# Altium schematic sheet 7.Humidifier.SchDoc
size A4; SheetNumber: 8; SheetTotal: 13
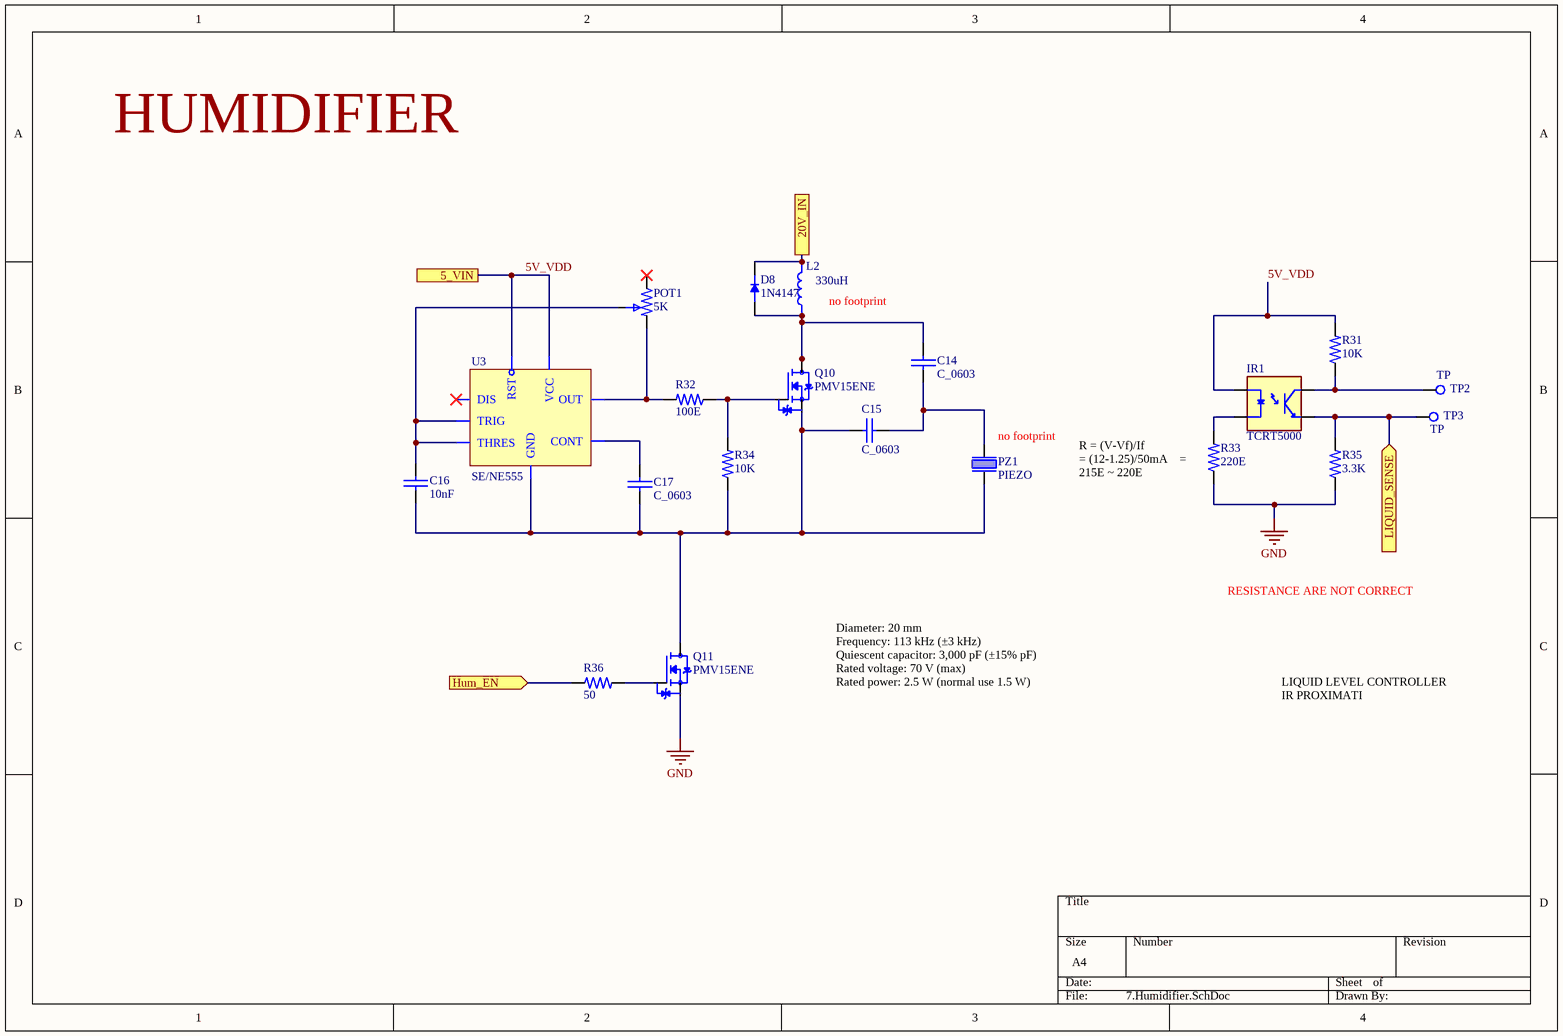
[diagram p0: 7.Humidifier.SchDoc]

## Parts
C14  C_0603  [C_0603]
C15  C_0603  [C_0603]
C16  10nF  [C_0603]
C17  C_0603  [C_0603]
D8  1N4147  [SOD123]
IR1  TCRT5000  [TCRT5000]
L2  330uH  [2P5mm_PITCH_COM]
POT1  5K  [TC33 - 3 mm SMD Trimpot]
PZ1  PIEZO  [2P5mm_PITCH_COM]
Q10  PMV15ENE  [SOT23FR]
Q11  PMV15ENE  [SOT23FR]
R31  10K  [R_0603]
R32  100E  [R_0603]
R33  220E  [R_0603]
R34  10K  [R_0603]
R35  3.3K  [R_0603]
R36  50  [R_0603]
TP2  TP
TP3  TP
U3  SE/NE555  [SOIC-8]

## Ports
5_VIN, 20V_IN, Hum_EN (in), LIQUID_SENSE (in)

## Nets
GND: Q11.3(S) R33.1 R35.1
5V_VDD: IR1.A R31.2 U3.4(RST) U3.8(VCC) ; port 5_VIN
20V_IN: D8.C(K) L2.2 ; port 20V_IN
Hum_EN: R36.1 ; port Hum_EN
LIQUID_SENSE: IR1.E R35.2 TP3.1 ; port LIQUID_SENSE
NetC14_1: C14.1 C15.1 PZ1.2
NetC14_2: C14.2 D8.A L2.1 Q10.1(D)
NetC15_2: C15.2 C16.1 C17.1 PZ1.1 Q10.3(S) Q11.1(D) R34.1 U3.1(GND)
NetC16_2: C16.2 POT1.2(W) U3.2(TRIG) U3.6(THRES)
NetC17_2: C17.2 U3.5(CONT)
NetIR1_CATH: IR1.CATH R33.2
NetIR1_COLL: IR1.COLL R31.1 TP2.1
NetPOT1_3: POT1.3(CW) R32.2 U3.3(OUT)
NetQ10_2: Q10.2(G) R32.1 R34.2
NetQ11_2: Q11.2(G) R36.2

Not connected (* = marked no-connect by the designer): POT1 1(CCW)*; U3 7(DIS)*

## Notes on the sheet
- HUMIDIFIER
- (near L2) no footprint
- (near PZ1) no footprint
- (near R33) R = (V-Vf)/If             = (12-1.25)/50mA    = 215E ~ 220E
- RESISTANCE ARE NOT CORRECT
- Diameter: 20 mm
  Frequency: 113 kHz (±3 kHz)
  Quiescent capacitor: 3,000 pF (±15% pF)
  Rated voltage: 70 V (max)
  Rated power: 2.5 W (normal use 1.5 W)
- LIQUID LEVEL CONTROLLER   IR PROXIMATI

## Library data of the parts
C16 = C_0603: D: *; MFR: *; P: *; PN: *; URL: *
D8 = 1N4147: MFR: Panjit; PN: 1N4148W_R2_00001; D: Diodes - General Purpose, Power, Switching SURFACE MOUNT SWITCHING DIODES; P: SOD123; URL: https://www.mouser.in/ProductDetail/Panjit/1N4148W_R2_00001?qs=sPbYRqrBIVlsNrvmMQOkFA%3D%3D
IR1 = TCRT5000: MFR: Vishay Semiconductors; D: Optical Switches, Reflective, Phototransistor; PN: TCRT5000L; P: *; URL: https://www.mouser.in/ProductDetail/Vishay-Semiconductors/TCRT5000L?qs=%2Fjqivxn91cdBAizhsWilRQ%3D%3D
L2 = L_COM
POT1 = TC33 - 3 mm SMD Trimpot: MFR: Bourns; D: Trimmer Resistors - SMD 3MM 5KOHMS 25% 0.1WATT OPEN FRM; P: SMD; PN: TC33X-2-502E; URL: https://www.mouser.in/ProductDetail/Bourns/TC33X-2-502E?qs=r%252B5EJQndA0pTgyiJsDuA%252BA%3D%3D
Q10 Q11 = PMV15ENE: MFR: Nexperia; P: SOT-23-3; PN: PMV15ENER; D: MOSFET PMV15ENE/SOT23/TO-236AB; URL: https://www.mouser.in/ProductDetail/Nexperia/PMV15ENER?qs=Li%252BoUPsLEntpTHKsialBmQ%3D%3D
R31-R36 = R_0603: D: *; MFR: *; P: *; PN: *; URL: *
U3 = SE/NE555: MFR: Diodes Incorporated; D: Timers & Support Products Automotive Grade Precision Timer; PN: SE555QS-13; P: SOIC-8; URL: https://www.mouser.in/ProductDetail/Diodes-Incorporated/SE555QS-13?qs=MHUP4w%2FlnDyIUxZVHd9p8w%3D%3D
C14 C15 C17 = C_0603: D: *; MFR: *; P: *; PN: *; URL: *